# Altium schematic sheet FPGA PERIPHERALS.SchDoc
size 393 x 281 mm; SheetNumber: 5; SheetTotal: 12
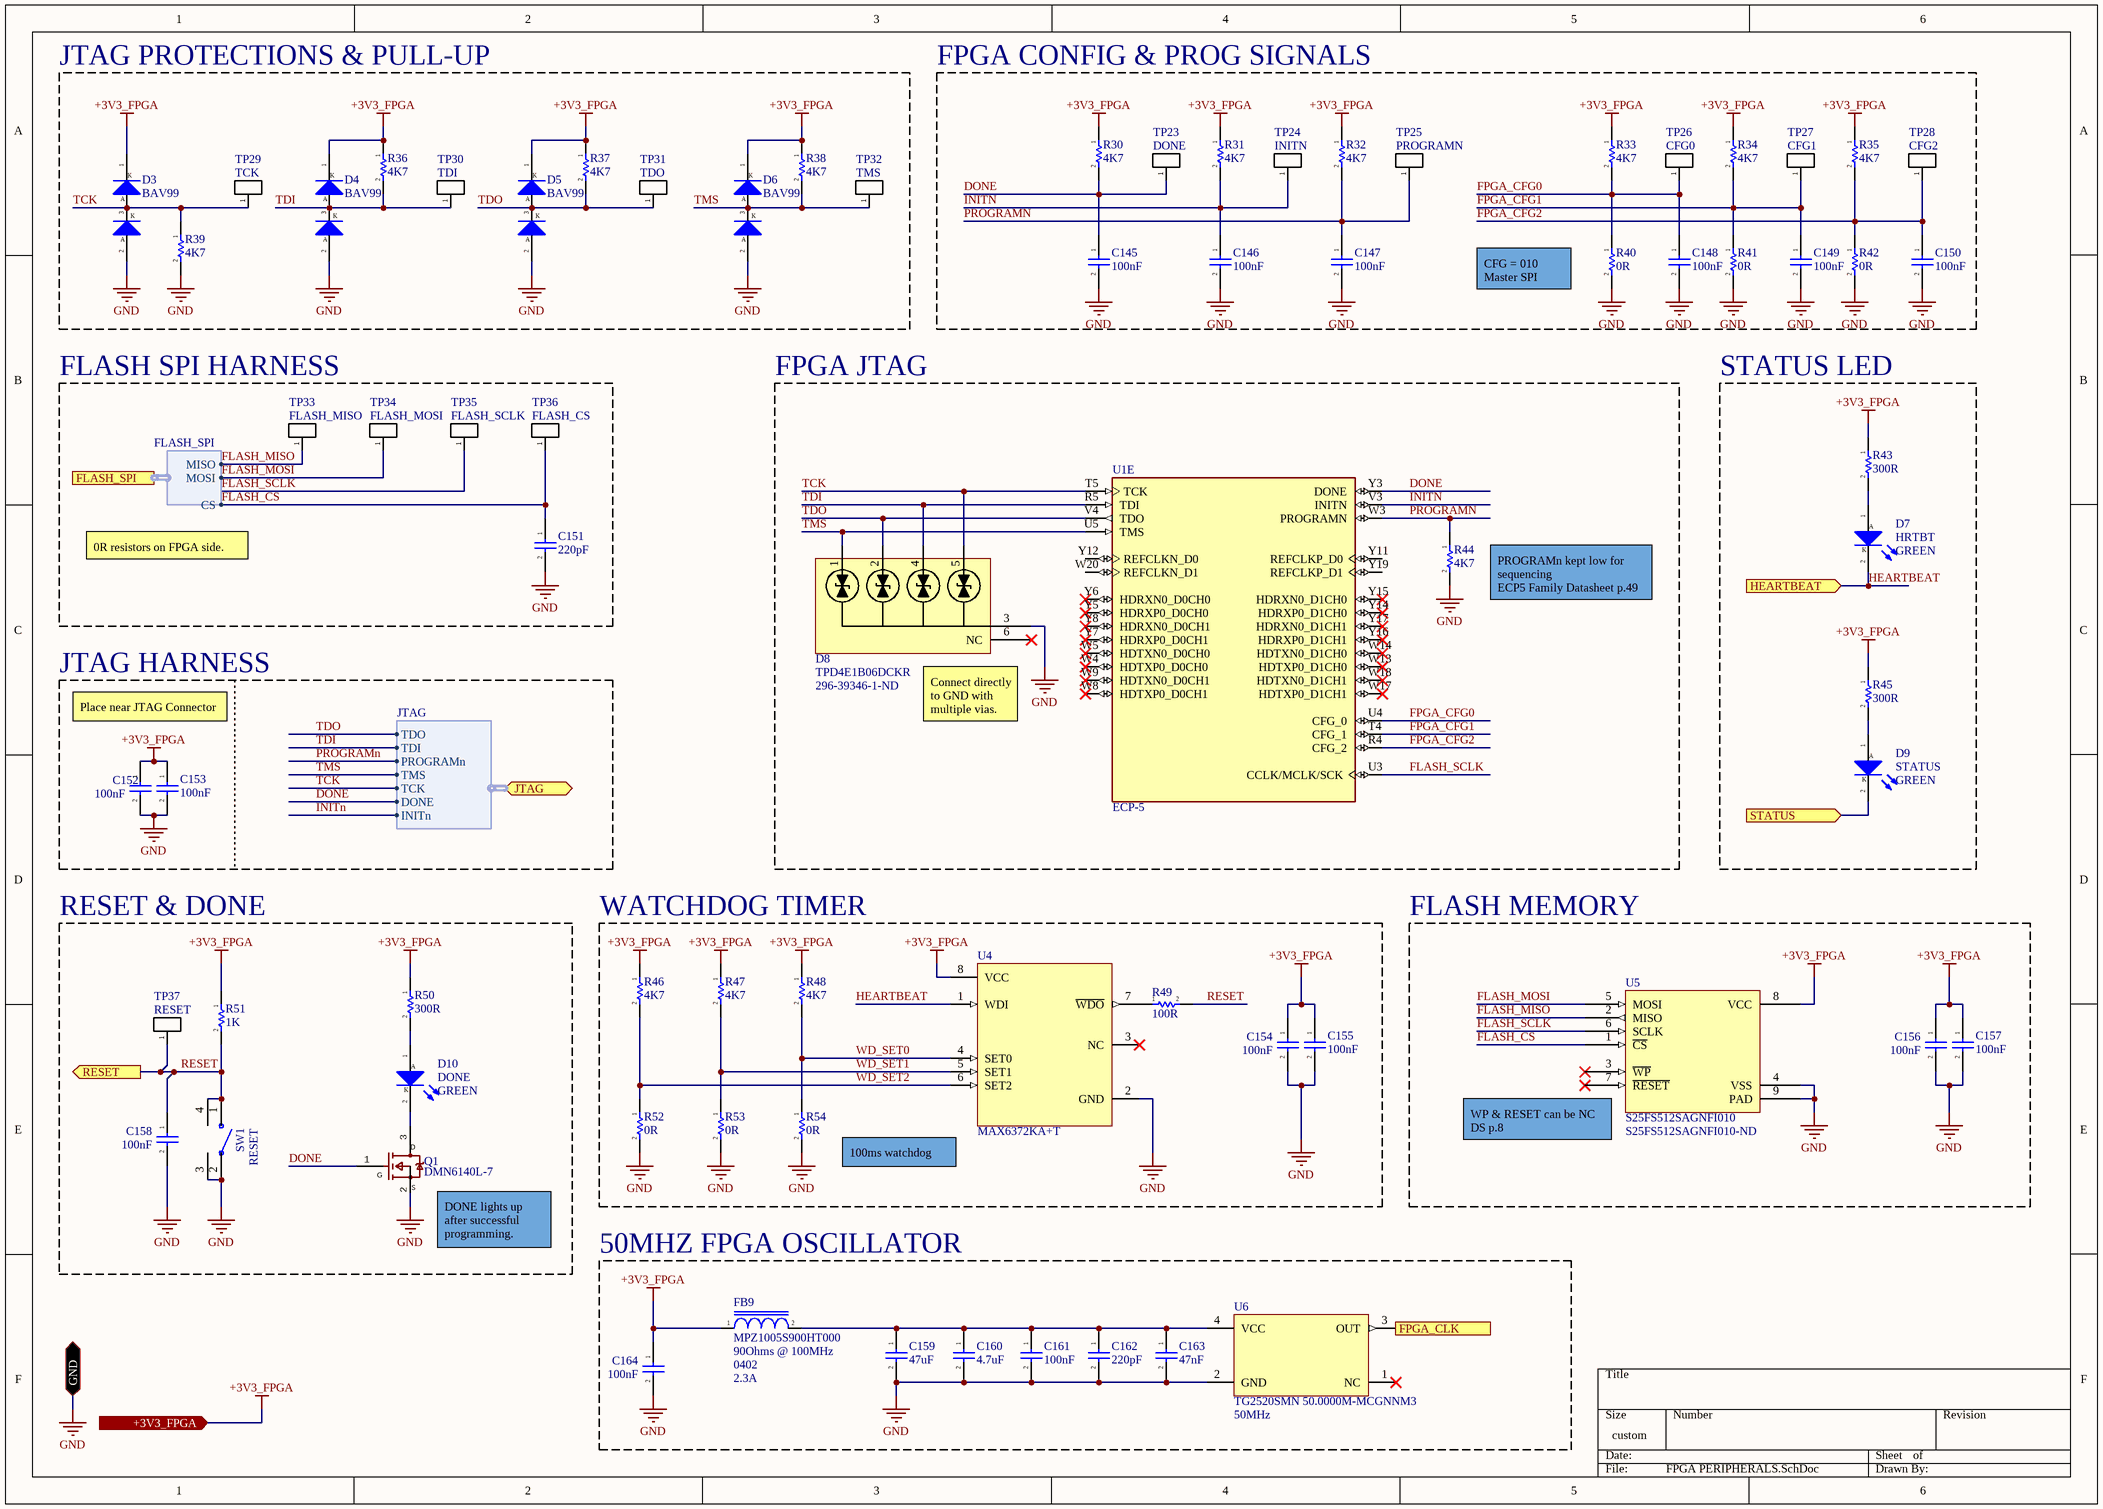
[diagram p0: FPGA PERIPHERALS.SchDoc]

## Parts
C145  100nF  [CAP_0402]
C146  100nF  [CAP_0402]
C147  100nF  [CAP_0402]
C148  100nF  [CAP_0402]
C149  100nF  [CAP_0402]
C150  100nF  [CAP_0402]
C151  220pF  [CAP_0402]
C152  100nF  [CAP_0402]
C153  100nF  [CAP_0402]
C154  100nF  [CAP_0402]
C155  100nF  [CAP_0402]
C156  100nF  [CAP_0402]
C157  100nF  [CAP_0402]
C158  100nF  [CAP_0402]
C159  47uF  [CAP_1206]
C160  4.7uF  [CAP_0805]
C161  100nF  [CAP_0402]
C162  220pF  [CAP_0402]
C163  47nF  [CAP_0201]
C164  100nF  [CAP_0402]
D3  BAV99  [MMBD7000-7-F]
D4  BAV99  [MMBD7000-7-F]
D5  BAV99  [MMBD7000-7-F]
D6  BAV99  [MMBD7000-7-F]
D7  HRTBT  Color: GREEN  [LED_0402]
D8  TPD4E1B06DCKR  Supplier Part Number 1: 296-39346-1-ND  [TPD4E1B06DCKR]
D9  STATUS  Color: GREEN  [LED_0402]
D10  DONE  Color: GREEN  [LED_0402]
FB9  MPZ1005S900HT000  Impedance @ Freq: 90Ohms @ 100MHz  Package / Case: 0402  Current Rating: 2.3A  [IND_0402]
Q1  DMN6140L-7  [SOT23-3]
R30  4K7  [RES_0603]
R31  4K7  [RES_0603]
R32  4K7  [RES_0603]
R33  4K7  [RES_0603]
R34  4K7  [RES_0603]
R35  4K7  [RES_0603]
R36  4K7  [RES_0603]
R37  4K7  [RES_0603]
R38  4K7  [RES_0603]
R39  4K7  [RES_0603]
R40  0R  [RES_0603]
R41  0R  [RES_0603]
R42  0R  [RES_0603]
R43  300R  [RES_0603]
R44  4K7  [RES_0603]
R45  300R  [RES_0603]
R46  4K7  [RES_0603]
R47  4K7  [RES_0603]
R48  4K7  [RES_0603]
R49  100R  [RES_0402]
R50  300R  [RES_0603]
R51  1K  [RES_0603]
R52  0R  [RES_0603]
R53  0R  [RES_0603]
R54  0R  [RES_0603]
SW1  RESET  [KMR621NGLFS]
TP23  DONE  [TP_PAD_TINY]  (no BOM)
TP24  INITN  [TP_PAD_TINY]  (no BOM)
TP25  PROGRAMN  [TP_PAD_TINY]  (no BOM)
TP26  CFG0  [TP_PAD_TINY]  (no BOM)
TP27  CFG1  [TP_PAD_TINY]  (no BOM)
TP28  CFG2  [TP_PAD_TINY]  (no BOM)
TP29  TCK  [TP_PAD_SMALL]  (no BOM)
TP30  TDI  [TP_PAD_SMALL]  (no BOM)
TP31  TDO  [TP_PAD_SMALL]  (no BOM)
TP32  TMS  [TP_PAD_SMALL]  (no BOM)
TP33  FLASH_MISO  [TP_PAD_SMALL]  (no BOM)
TP34  FLASH_MOSI  [TP_PAD_SMALL]  (no BOM)
TP35  FLASH_SCLK  [TP_PAD_SMALL]  (no BOM)
TP36  FLASH_CS  [TP_PAD_SMALL]  (no BOM)
TP37  RESET  [TP_PAD_SMALL]  (no BOM)
U1  ECP-5  [CABGA-381]  (part E of 7)
U4  MAX6372KA+T  [SOT23-8]
U5  S25FS512SAGNFI010  Supplier Part Number 1: S25FS512SAGNFI010-ND  [s25FL256LAGNFV010]
U6  TG2520SMN 50.0000M-MCGNNM3  Frequency: 50MHz  [TG2520SMN]

## Blocks framed on the sheet
JTAG PROTECTIONS & PULL-UP: D3-D6 R36-R39 TP29-TP32
FPGA CONFIG & PROG SIGNALS: C145-C150 R30-R35 R40-R42 TP23-TP28
FLASH SPI HARNESS: C151 TP33-TP36
FPGA JTAG: D8 R44 U1
STATUS LED: D7 D9 R43 R45
JTAG HARNESS: C152 C153
RESET & DONE: C158 D10 Q1 R50 R51 SW1 TP37
WATCHDOG TIMER: C154 C155 R46-R49 R52-R54 U4
FLASH MEMORY: C156 C157 U5
50MHZ FPGA OSCILLATOR: C159-C164 FB9 U6

## Ports
+3V3_FPGA (in), FLASH_SPI (harness FLASH_SPI), FPGA_CLK (out), GND (bidir), HEARTBEAT (in), JTAG (bidir, harness JTAG), RESET (out), STATUS (in)

## Harnesses
JTAG: TDO, TDI, PROGRAMn, TMS, TCK, DONE, INITn
FLASH_SPI: MISO, MOSI, CS

## Nets
+3V3_FPGA: C152.1 C153.1 C154.1 C155.1 C156.1 C157.1 C164.1 D3.1(K) D4.1(K) D5.1(K) D6.1(K) FB9.1 R30.1 R31.1 R32.1 R33.1 R34.1 R35.1 R36.1 R37.1 R38.1 R43.1 R45.1 R46.1 R47.1 R48.1 R50.1 R51.1 U4.8(VCC) U5.8(VCC) ; port +3V3_FPGA
GND: C145.2 C146.2 C147.2 C148.2 C149.2 C150.2 C151.2 C152.2 C153.2 C154.2 C155.2 C156.2 C157.2 C158.2 C159.2 C160.2 C161.2 C162.2 C163.2 C164.2 D3.2(K) D4.2(K) D5.2(K) D6.2(K) D8.3(GND) Q1.2 R39.2 R40.2 R41.2 R42.2 R44.2 R52.2 R53.2 R54.2 SW1.2 SW1.3 U4.2(GND) U5.4(VSS) U5.9(PAD) U6.2(GND) ; port GND
DONE: C145.1 Q1.1 R30.2 TP23.1(A) U1.Y3(DONE) ; port JTAG.DONE
FLASH_CS: C151.1 TP36.1(A) U5.1(~{CS}) ; port FLASH_SPI.CS
FLASH_MISO: TP33.1(A) U5.2(MISO) ; port FLASH_SPI.MISO
FLASH_MOSI: TP34.1(A) U5.5(MOSI) ; port FLASH_SPI.MOSI
FLASH_SCLK: TP35.1(A) U1.U3(CCLK/MCLK/SCK) U5.6(SCLK)
FPGA_CFG0: C148.1 R33.2 R40.1 TP26.1(A) U1.U4(CFG_0)
FPGA_CFG1: C149.1 R34.2 R41.1 TP27.1(A) U1.T4(CFG_1)
FPGA_CFG2: C150.1 R35.2 R42.1 TP28.1(A) U1.R4(CFG_2)
FPGA_CLK: U6.3(OUT) ; port FPGA_CLK
HEARTBEAT: D7.2(K) U4.1(WDI) ; port HEARTBEAT
INITN: C146.1 R31.2 TP24.1(A) U1.V3(INITN) ; port JTAG.INITn
PROGRAMN: C147.1 R32.2 R44.1 TP25.1(A) U1.W3(PROGRAMN) ; port JTAG.PROGRAMn
RESET: C158.1 R49.2 R51.2 SW1.1 SW1.4 TP37.1(A) ; port RESET
STATUS: D9.2(K) ; port STATUS
TCK: D3.3(A) D8.5(A) R39.1 TP29.1(A) U1.T5(TCK) ; port JTAG.TCK
TDI: D4.3(A) D8.4(A) R36.2 TP30.1(A) U1.R5(TDI) ; port JTAG.TDI
TDO: D5.3(A) D8.2(A) R37.2 TP31.1(A) U1.V4(TDO) ; port JTAG.TDO
TMS: D6.3(A) D8.1(A) R38.2 TP32.1(A) U1.U5(TMS) ; port JTAG.TMS
WD_SET0: R48.2 R54.1 U4.4(SET0)
WD_SET1: R47.2 R53.1 U4.5(SET1)
WD_SET2: R46.2 R52.1 U4.6(SET2)
NetC159_1: C159.1 C160.1 C161.1 C162.1 C163.1 FB9.2 U6.4(VCC)
NetD7_1: D7.1(A) R43.2
NetD9_1: D9.1(A) R45.2
NetD10_1: D10.1(A) R50.2
NetD10_2: D10.2(K) Q1.3
NetR49_1: R49.1 U4.7(~{WDO})

Not connected (* = marked no-connect by the designer): D8 6(NC)*; U1 W4(HDTXP0_D0CH0)* W5(HDTXN0_D0CH0)* W8(HDTXP0_D0CH1)* W9(HDTXN0_D0CH1)* W13(HDTXP0_D1CH0)* W14(HDTXN0_D1CH0)* W17(HDTXP0_D1CH1)* W18(HDTXN0_D1CH1)* W20(REFCLKN_D1) Y5(HDRXP0_D0CH0)* Y6(HDRXN0_D0CH0)* Y7(HDRXP0_D0CH1)* Y8(HDRXN0_D0CH1)* Y11(REFCLKP_D0) Y12(REFCLKN_D0) Y14(HDRXP0_D1CH0)* Y15(HDRXN0_D1CH0)* Y16(HDRXP0_D1CH1)* Y17(HDRXN0_D1CH1)* Y19(REFCLKP_D1); U4 3(NC)*; U5 3(~{WP})* 7(~{RESET})*; U6 1(NC)*

## Notes on the sheet
- (near R40) CFG = 010
  Master SPI
- 0R resistors on FPGA side.
- (near R44) PROGRAMn kept low for sequencing
  ECP5 Family Datasheet p.49
- Place near JTAG Connector
- (near D8) Connect directly to GND with multiple vias.
- 100ms watchdog
- (near U5) WP & RESET can be NC
  DS p.8
- (near Q1) DONE lights up after successful programming.
- (in symbol TRANS_DMN6140L-7) D; G; S

## Library data of the parts
C145-C164 = CAP_CER: Generic SMT Ceramic Capacitor; Voltage - Rated: 25V; Operating Temperature: *; Tolerance: *; Mfr: *; ComponentLink1Description: Digikey; ComponentLink1URL: [Digikey Link]; Digikey Part No: *; ComponentLink2Description: Datasheet; ComponentLink2URL: [Datasheet Link]
  C145-C158 C161 C162 C164: Footprint: 0402
  C159: Footprint: 1206
  C160: Footprint: 0805
  C163: Footprint: 0201
D3-D6 = DIODE_BAV99: DIODE ARRAY GP 75V 300MA SOT23-3; Mfr: Taiwan Semiconductor Corporation; Diode Configuration: 1 Pair Series Connection; Current: 200mA; DC Reverse Voltage: 70V; Operating Temperature: -55C - 150C; Footprint: SOT-23
D7 D9 D10 = DIODE_LED: Generic LED; Forward Voltage: *; Wavelength: *
D8 = DIODE_TPD4E1B06DCKR: TVS DIODE 5.5VWM 14.5VC SC70-6; Mfr: Texas Instruments; Voltage - Reverse: 5.5V; Breakdown Voltage: 7V; Clamping Voltage: 14.5V; Current Peak (10/1ms): 3A; Power Peak: 45W; Operating Temperature: -40C - 125C; Supplier 1: Digi-Key
FB9 = IND_MPZ1005S900HT000: 90 Ohms @ 100 MHz 1 Power Line Ferrite Bead 0402 (1005 Metric) 2.3A 38mOhm; Resistance: 38mOhms; Operating Temperature: -55C - 125C; Rating: AEC-Q200
Q1 = TRANS_DMN6140L-7: N-Channel 60 V 1.6A (Ta) 700mW (Ta) Surface Mount SOT-23; Mfr: Diodes Incorporated; Vds: 60V; Rds ON: 140mR; Vgs: 3V; Package / Case: SOT-23; Operating Temperature: -55C - 150C; Current: 1.6A
R30-R39 R44 R46-R48 = RESISTOR: Power: 1/16W; Tolerance: 10%; Automotive: *; Operating Temperature: *; # Digikey: *; ComponentLink1Description: Digikey; ComponentLink1URL: *; # Manufacturer: *; Package / Case: 0603
R40-R42 R49 R52-R54 = RESISTOR: Power: 1/8W; Tolerance: 10%; Automotive: *; Operating Temperature: *; # Digikey: *; ComponentLink1Description: Digikey; ComponentLink1URL: *; # Manufacturer: *
  R40-R42 R52-R54: Package / Case: 0603
  R49: Package / Case: 0402
R43 R45 R50 = RESISTOR: Power: 1/8W; Tolerance: 2%; Automotive: *; Operating Temperature: *; # Digikey: *; ComponentLink1Description: Digikey; ComponentLink1URL: *; # Manufacturer: *; Package / Case: 0603
R51 = RESISTOR: Power: 1/8W; Tolerance: 5%; Automotive: *; Operating Temperature: *; # Digikey: *; ComponentLink1Description: Digikey; ComponentLink1URL: *; # Manufacturer: *; Package / Case: 0603
SW1 = SW_KMR621NG_LFS: Tactile Switch SPST-NO Top Actuated Surface Mount; Mfr: C&K; Alternative Part: KMR641NG ULC LFS; Contact Rating: 50mA @ 32V; Type: SPST-NO; Operating Temperature: -40C to 85C; Supplier 1: Newark; Supplier Part Number 1: 35AH0964; Digikey #: CKN10686CT-ND; ComponentLink1Description: Digikey; ComponentLink1URL: https://www.digikey.ca/en/products/detail/c-k/KMR641NG-ULC-LFS/6035352; ComponentLink2Description: Datasheet; ComponentLink2URL: https://www.ckswitches.com/media/1907/kmr6.pdf
TP23-TP37 = TESTPOINT: Test Point
U1 = IC_LFE5UM-45F-8BG381C: IC FPGA 203 I/O 381CABGA; Mfr: Lattice Semiconductors; Supply Voltage: 1.045V - 1.115V; LABs/CLBs: 11000; Logic Elements: 44000; IOs: 203; RAM Bits: 1990656; Operating Temperature: 0C - 85C; Package / Case: 381-CABGA
U4 = IC_MAX6372KA-T: Watchdog Push-Pull, Totem Pole 1 Channel SOT-23-8; Mfr: Maxim Integrated; Timeout: Adjustable 1ms - 10s; Temperature: -40C - 125C; Supplier 1: Mouser; ComponentLink1Description: Digikey; ComponentLink1URL: https://www.digikey.ca/en/products/detail/analog-devices-inc-maxim-integrated/MAX6372KA-T/1518602; ComponentLink2Description: Datasheet; ComponentLink2URL: https://datasheets.maximintegrated.com/en/ds/MAX6369-MAX6374.pdf; Supplier Part Number 1: 700-MAX6372KAT
U5 = IC_S25FS512SAGNFI010: FLASH - NOR Memory IC 512Mb (64M x 8) SPI - Quad I/O, QPI 133 MHz 8-WSON (6x8); Mfr: Cypress; Memory Size: 512Mbits; Clock Frequency: 133MHz; Supply Voltage: 2.7V - 3.6V; Supplier 1: Digi-Key; Package: WSON-8 (8x6); Operating Temperature: -40C - 105C; ComponentLink1Description: Digikey; ComponentLink1URL: https://www.digikey.ca/en/products/detail/cypress-semiconductor-corp/S25FS512SAGNFI010/6596268; ComponentLink2Description: Datasheet; ComponentLink2URL: https://www.infineon.com/dgdl/Infineon-S25FS512S_512_Mb_1.8_V_Serial_Peripheral_Interface_with_Multi-I_O_Non-Volatile_Flash-DataSheet-v14_00-EN.pdf?fileId=8ac78c8c7d0d8da4017d0ed681a356fe&utm_source=cypress&utm_medium=referral&utm_campaign=202110_globe_en_all_integration-files
U6 = IC_TG2520SMN_50.0000M-MCGNNM3: 50 MHz TCXO Clipped Sine Wave Oscillator 2.8V ~ 3.3V - 4-SMD, No Lead; Mfr: EPSON; Supply Voltage: 2.8V - 3.3V; Frequency Stability: 500ppb; Supply Current: 2mA; Type: TCXO; Operating Temperature: -40C to 85C; Supplier 1: Digi-Key; Supplier Part Number 1: 114-TG2520SMN50.0000M-MCGNNM3CT-ND; ComponentLink1Description: Digikey; ComponentLink1URL: https://www.digikey.ca/en/products/detail/epson/TG2520SMN-50-0000M-MCGNNM3/13151939; ComponentLink2Description: Datasheet; ComponentLink2URL: https://support.epson.biz/td/api/doc_check.php?dl=brief_TG2520SMN&lang=en; ComponentLink3Description: Manufacturer; ComponentLink3URL: https://www5.epsondevice.com/en/products/tcxo/tg2520smn.html